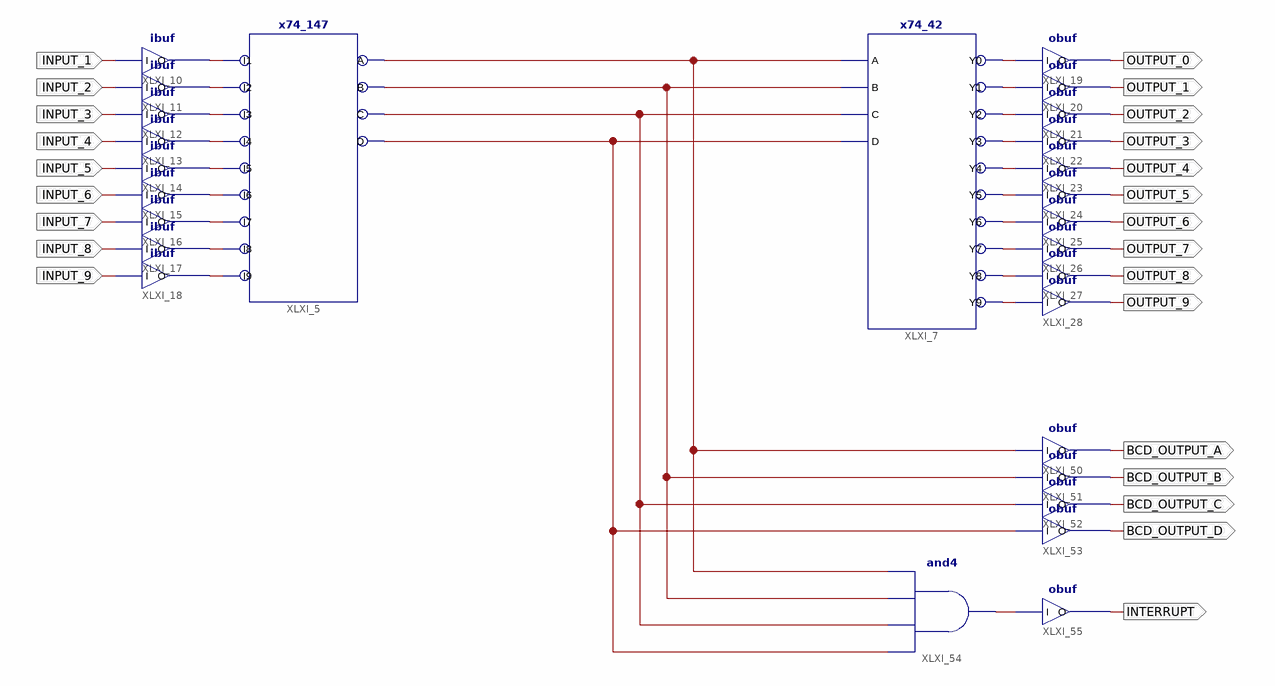
[diagram p0: schematic sheet 1]
// Xilinx ISE schematic PriorityDecoder.sch (xbr) as structural Verilog: 27 symbols, 24 ports
module PriorityDecoder (
  input  INPUT_1,
  input  INPUT_2,
  input  INPUT_3,
  input  INPUT_4,
  input  INPUT_5,
  input  INPUT_6,
  input  INPUT_7,
  input  INPUT_8,
  input  INPUT_9,
  output OUTPUT_0,
  output OUTPUT_1,
  output OUTPUT_2,
  output OUTPUT_3,
  output OUTPUT_4,
  output OUTPUT_5,
  output OUTPUT_6,
  output OUTPUT_7,
  output OUTPUT_8,
  output OUTPUT_9,
  output BCD_OUTPUT_A,
  output BCD_OUTPUT_B,
  output BCD_OUTPUT_C,
  output BCD_OUTPUT_D,
  output INTERRUPT
);

  wire XLXN_4, XLXN_5, XLXN_6, XLXN_7, XLXN_8, XLXN_9, XLXN_10, XLXN_11, XLXN_12, XLXN_13, XLXN_14, XLXN_15,
       XLXN_16, XLXN_17, XLXN_18, XLXN_19, XLXN_20, XLXN_21, XLXN_22, XLXN_23, XLXN_81, XLXN_89, XLXN_91,
       XLXN_92;

  x74_147 XLXI_5 (
    .I1(XLXN_5), .I2(XLXN_6), .I3(XLXN_7), .I4(XLXN_8), .I5(XLXN_9), .I6(XLXN_10), .I7(XLXN_11),
    .I8(XLXN_12), .I9(XLXN_13), .A(XLXN_81), .B(XLXN_91), .C(XLXN_92), .D(XLXN_4));
  ibuf XLXI_10 (.I(INPUT_1), .O(XLXN_5));
  ibuf XLXI_11 (.I(INPUT_2), .O(XLXN_6));
  ibuf XLXI_12 (.I(INPUT_3), .O(XLXN_7));
  ibuf XLXI_13 (.I(INPUT_4), .O(XLXN_8));
  ibuf XLXI_14 (.I(INPUT_5), .O(XLXN_9));
  ibuf XLXI_15 (.I(INPUT_6), .O(XLXN_10));
  ibuf XLXI_16 (.I(INPUT_7), .O(XLXN_11));
  ibuf XLXI_17 (.I(INPUT_8), .O(XLXN_12));
  ibuf XLXI_18 (.I(INPUT_9), .O(XLXN_13));
  x74_42 XLXI_7 (
    .A(XLXN_81), .B(XLXN_91), .C(XLXN_92), .D(XLXN_4), .Y0(XLXN_14), .Y1(XLXN_15), .Y2(XLXN_16),
    .Y3(XLXN_17), .Y4(XLXN_18), .Y5(XLXN_19), .Y6(XLXN_20), .Y7(XLXN_21), .Y8(XLXN_22), .Y9(XLXN_23));
  obuf XLXI_19 (.I(XLXN_14), .O(OUTPUT_0));
  obuf XLXI_20 (.I(XLXN_15), .O(OUTPUT_1));
  obuf XLXI_21 (.I(XLXN_16), .O(OUTPUT_2));
  obuf XLXI_22 (.I(XLXN_17), .O(OUTPUT_3));
  obuf XLXI_23 (.I(XLXN_18), .O(OUTPUT_4));
  obuf XLXI_24 (.I(XLXN_19), .O(OUTPUT_5));
  obuf XLXI_25 (.I(XLXN_20), .O(OUTPUT_6));
  obuf XLXI_26 (.I(XLXN_21), .O(OUTPUT_7));
  obuf XLXI_27 (.I(XLXN_22), .O(OUTPUT_8));
  obuf XLXI_28 (.I(XLXN_23), .O(OUTPUT_9));
  obuf XLXI_50 (.I(XLXN_81), .O(BCD_OUTPUT_A));
  obuf XLXI_51 (.I(XLXN_91), .O(BCD_OUTPUT_B));
  obuf XLXI_52 (.I(XLXN_92), .O(BCD_OUTPUT_C));
  obuf XLXI_53 (.I(XLXN_4), .O(BCD_OUTPUT_D));
  and XLXI_54 (XLXN_89, XLXN_4, XLXN_92, XLXN_91, XLXN_81);
  obuf XLXI_55 (.I(XLXN_89), .O(INTERRUPT));
endmodule
